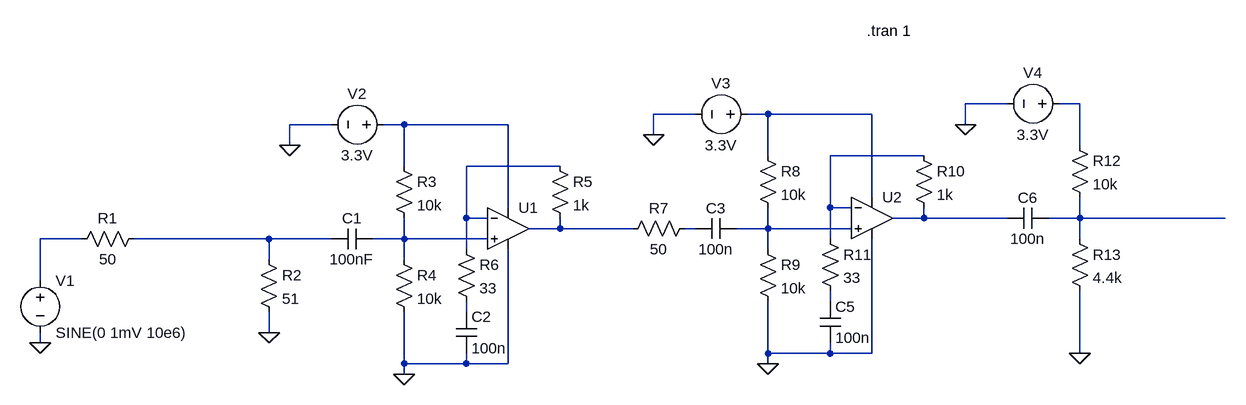
[diagram p0: schematic IF_AMP.asc]
IF_AMP.asc, the LTspice schematic file:
Version 4
SHEET 1 1812 680
WIRE 1472 -176 1408 -176
WIRE 1584 -176 1552 -176
WIRE 992 -160 928 -160
WIRE 1104 -160 1072 -160
WIRE 1264 -160 1104 -160
WIRE 432 -144 368 -144
WIRE 544 -144 512 -144
WIRE 704 -144 544 -144
WIRE 1408 -144 1408 -176
WIRE 928 -128 928 -160
WIRE 368 -112 368 -144
WIRE 1584 -112 1584 -176
WIRE 1104 -96 1104 -160
WIRE 1344 -96 1200 -96
WIRE 544 -80 544 -144
WIRE 784 -80 640 -80
WIRE 1264 -32 1264 -160
WIRE 704 -16 704 -144
WIRE 1200 -16 1200 -96
WIRE 1232 -16 1200 -16
WIRE 640 0 640 -80
WIRE 672 0 640 0
WIRE 1344 0 1344 -16
WIRE 1344 0 1296 0
WIRE 1472 0 1344 0
WIRE 1584 0 1584 -32
WIRE 1584 0 1536 0
WIRE 1808 0 1584 0
WIRE 784 16 784 0
WIRE 784 16 736 16
WIRE 896 16 784 16
WIRE 992 16 976 16
WIRE 1104 16 1104 -16
WIRE 1104 16 1056 16
WIRE 1232 16 1104 16
WIRE 48 32 -16 32
WIRE 336 32 128 32
WIRE 432 32 336 32
WIRE 544 32 544 0
WIRE 544 32 496 32
WIRE 672 32 544 32
WIRE 1200 32 1200 -16
WIRE 1584 32 1584 0
WIRE 640 48 640 0
WIRE 1104 48 1104 16
WIRE 336 64 336 32
WIRE 544 64 544 32
WIRE -16 96 -16 32
WIRE 1200 128 1200 112
WIRE 640 144 640 128
WIRE 336 176 336 144
WIRE -16 192 -16 176
WIRE 1104 208 1104 128
WIRE 1200 208 1200 192
WIRE 1200 208 1104 208
WIRE 1264 208 1264 32
WIRE 1264 208 1200 208
WIRE 1584 208 1584 112
WIRE 544 224 544 144
WIRE 640 224 640 208
WIRE 640 224 544 224
WIRE 704 224 704 48
WIRE 704 224 640 224
WIRE 1104 224 1104 208
WIRE 544 240 544 224
FLAG -16 192 0
FLAG 336 176 0
FLAG 368 -112 0
FLAG 544 240 0
FLAG 928 -128 0
FLAG 1104 224 0
FLAG 1408 -144 0
FLAG 1584 208 0
SYMBOL voltage -16 80 R0
WINDOW 123 0 0 Left 0
WINDOW 39 0 0 Left 0
SYMATTR InstName V1
SYMATTR Value SINE(0 1mV 10e6)
SYMBOL res 144 16 R90
WINDOW 0 0 56 VBottom 2
WINDOW 3 32 56 VTop 2
SYMATTR InstName R1
SYMATTR Value 50
SYMBOL res 320 48 R0
SYMATTR InstName R2
SYMATTR Value 51
SYMBOL cap 496 16 R90
WINDOW 0 0 32 VBottom 2
WINDOW 3 32 32 VTop 2
SYMATTR InstName C1
SYMATTR Value 100nF
SYMBOL res 528 -96 R0
SYMATTR InstName R3
SYMATTR Value 10k
SYMBOL res 528 48 R0
SYMATTR InstName R4
SYMATTR Value 10k
SYMBOL voltage 528 -144 R90
WINDOW 0 -32 56 VBottom 2
WINDOW 3 32 56 VTop 2
WINDOW 123 0 0 Left 0
WINDOW 39 0 0 Left 0
SYMATTR InstName V2
SYMATTR Value 3.3V
SYMBOL OpAmps\\UniversalOpAmp 704 16 R0
SYMATTR InstName U1
SYMATTR Value2 Avol=1Meg GBW=800Meg Vos=0
SYMBOL res 768 -96 R0
SYMATTR InstName R5
SYMATTR Value 1k
SYMBOL res 624 32 R0
SYMATTR InstName R6
SYMATTR Value 33
SYMBOL cap 624 144 R0
SYMATTR InstName C2
SYMATTR Value 100n
SYMBOL res 992 0 R90
WINDOW 0 0 56 VBottom 2
WINDOW 3 32 56 VTop 2
SYMATTR InstName R7
SYMATTR Value 50
SYMBOL cap 1056 0 R90
WINDOW 0 0 32 VBottom 2
WINDOW 3 32 32 VTop 2
SYMATTR InstName C3
SYMATTR Value 100n
SYMBOL res 1088 -112 R0
SYMATTR InstName R8
SYMATTR Value 10k
SYMBOL res 1088 32 R0
SYMATTR InstName R9
SYMATTR Value 10k
SYMBOL voltage 1088 -160 R90
WINDOW 0 -32 56 VBottom 2
WINDOW 3 32 56 VTop 2
WINDOW 123 0 0 Left 0
WINDOW 39 0 0 Left 0
SYMATTR InstName V3
SYMATTR Value 3.3V
SYMBOL OpAmps\\UniversalOpAmp 1264 0 R0
SYMATTR InstName U2
SYMATTR Value2 Avol=1Meg GBW=800Meg Vos=0
SYMBOL res 1328 -112 R0
SYMATTR InstName R10
SYMATTR Value 1k
SYMBOL res 1184 16 R0
SYMATTR InstName R11
SYMATTR Value 33
SYMBOL cap 1184 128 R0
SYMATTR InstName C5
SYMATTR Value 100n
SYMBOL cap 1536 -16 R90
WINDOW 0 0 32 VBottom 2
WINDOW 3 32 32 VTop 2
SYMATTR InstName C6
SYMATTR Value 100n
SYMBOL res 1568 -128 R0
SYMATTR InstName R12
SYMATTR Value 10k
SYMBOL res 1568 16 R0
SYMATTR InstName R13
SYMATTR Value 4.4k
SYMBOL voltage 1568 -176 R90
WINDOW 0 -32 56 VBottom 2
WINDOW 3 32 56 VTop 2
WINDOW 123 0 0 Left 0
WINDOW 39 0 0 Left 0
SYMATTR InstName V4
SYMATTR Value 3.3V
TEXT 1256 -288 Left 2 !.tran 1

The netlist it stands for:
* IF_AMP.asc
V1 N011 0 SINE(0 1mV 10e6)
R1 N012 N011 50
R2 N012 0 51
C1 N013 N012 100nF
R3 N003 N013 10k
R4 N013 0 10k
V2 N003 0 3.3V
XU1 N013 N005 N003 0 N008 level1 Avol=1Meg GBW=800Meg Vos=0 En=0 Enk=0 In=0 Ink=0 Rin=500Meg  ; pins In+ In- V+ V- OUT
R5 N005 N008 1k
R6 N005 N015 33
C2 N015 0 100n
R7 N009 N008 50
C3 N010 N009 100n
R8 N002 N010 10k
R9 N010 0 10k
V3 N002 0 3.3V
XU2 N010 N004 N002 0 N006 level1 Avol=1Meg GBW=800Meg Vos=0 En=0 Enk=0 In=0 Ink=0 Rin=500Meg  ; pins In+ In- V+ V- OUT
R10 N004 N006 1k
R11 N004 N014 33
C5 N014 0 100n
C6 N007 N006 100n
R12 N001 N007 10k
R13 N007 0 4.4k
V4 N001 0 3.3V
.tran 1
.lib UniversalOpAmp1.lib
.backanno
.end